# Altium schematic sheet GeekIMUv1.SchDoc
size 381 x 190 mm
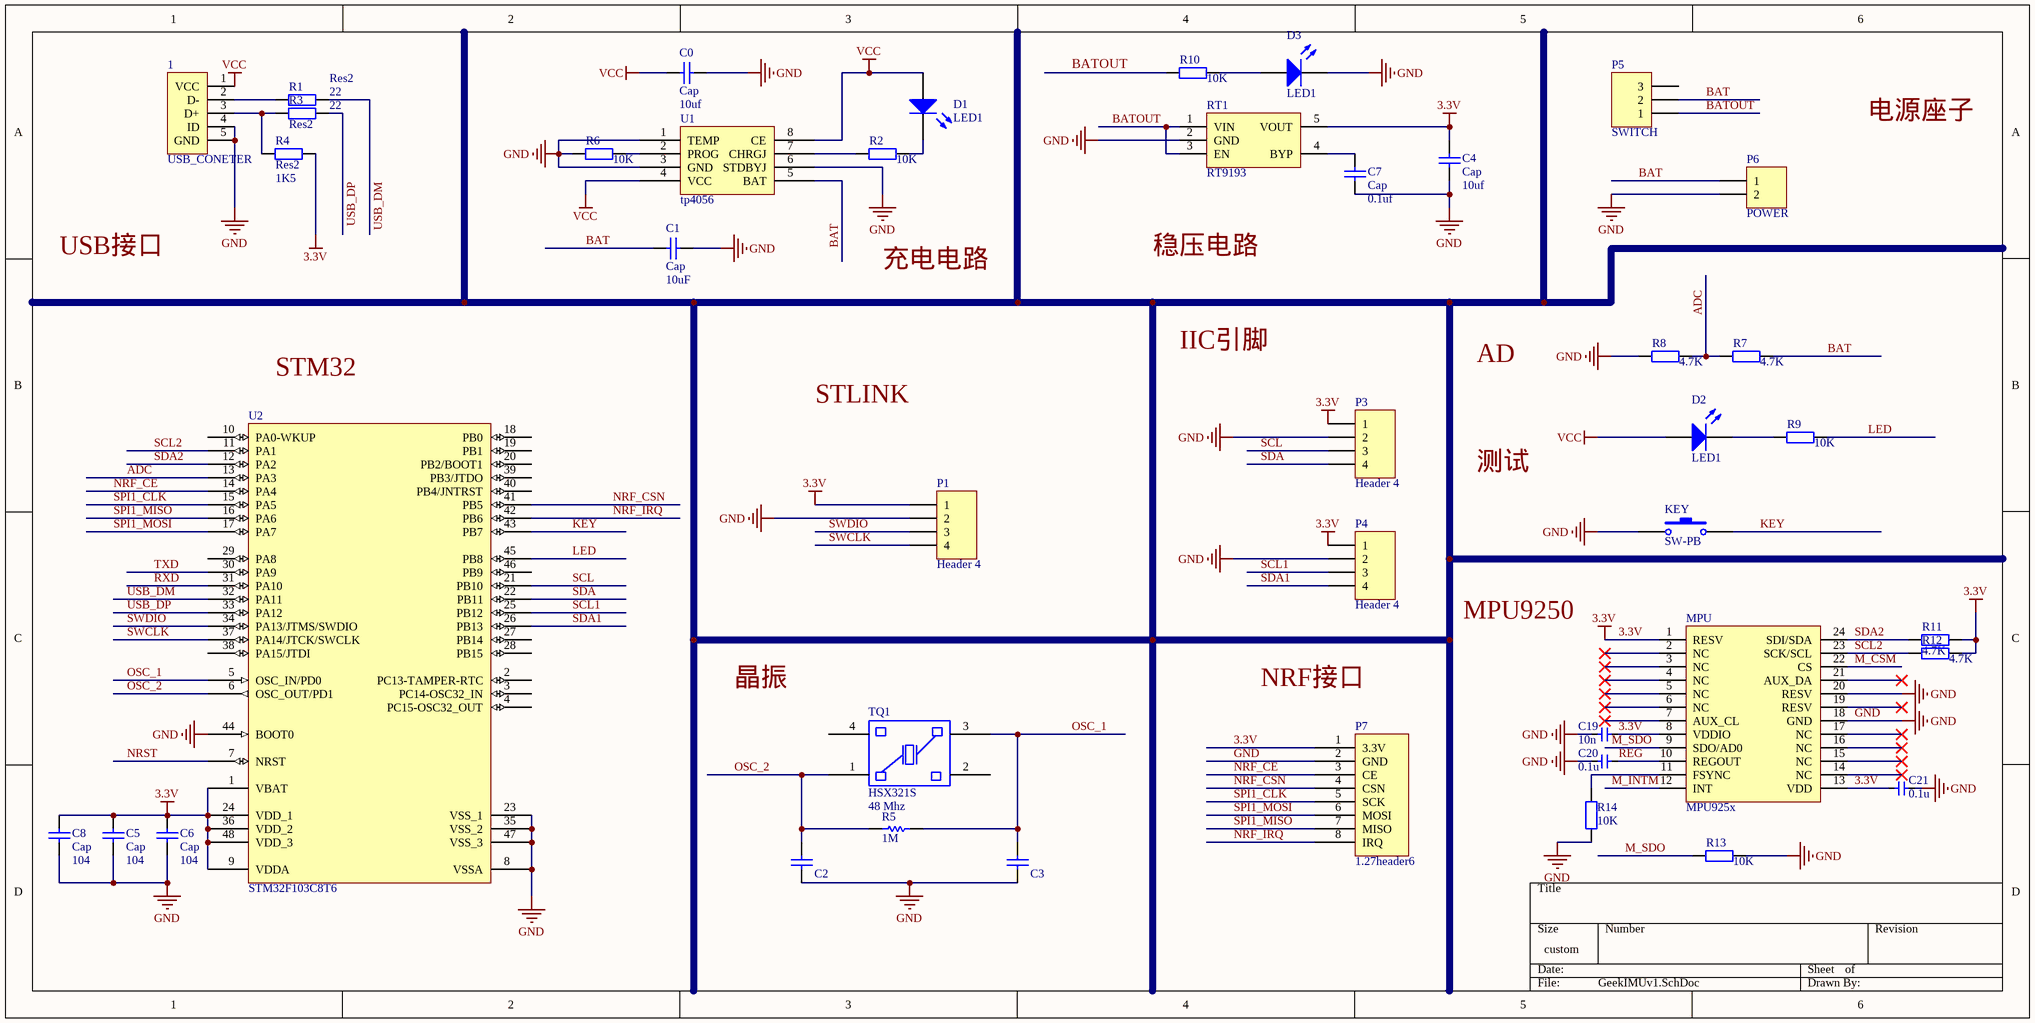
[diagram p0: GeekIMUv1.SchDoc]

## Parts
1  USB_CONETER  [Mini USB]
C0  Cap  value 10uf  [C0603]
C1  Cap  value 10uF  [C0603]
C2  Cap  [C0402]  (value not drawn)
C3  Cap  [C0402]  (value not drawn)
C4  Cap  value 10uf  [C0603]
C5  Cap  value 104  [C0402]
C6  Cap  value 104  [C0402]
C7  Cap  value 0.1uf  [B0402]
C8  Cap  value 104  [C0402]
C19  value 10n  [C0402]  (hidden comment: Cap_0603)
C20  value 0.1u  [C0402]  (hidden comment: Cap_0603)
C21  value 0.1u  [C0402]  (hidden comment: Cap_0603)
D1  LED1  [C0402]
D2  LED1  [C0402]
D3  LED1  [C0402]
KEY  SW-PB  [SW-SMD1]
MPU  MPU925x  [QFN_P0.4_24]
P1  Header 4  [HDR1X4]
P3  Header 4  [HDR1X4]
P4  Header 4  [HDR1X4]
P5  SWITCH  [HDR1X3]
P6  POWER  [HDR1X2]
P7  1.27header6  [1.27header6]
R1  Res2  value 22  [B0402]
R2  value 10K  [B0402]
R3  Res2  value 22  [B0402]
R4  Res2  value 1K5  [B0402]
R5  value 1M  [R0402]  (hidden comment: Res Semi)
R6  value 10K  [B0402]
R7  value 4.7K  [B0402]
R8  value 4.7K  [B0402]
R9  value 10K  [B0402]
R10  value 10K  [B0402]
R11  value 4.7K  [B0402]
R12  value 4.7K  [B0402]
R13  value 10K  [B0402]
R14  value 10K  [B0402]
RT1  RT9193  [SOT23-5]
TQ1  HSX321S  value 48 Mhz  [DSX321G]
U1  tp4056  [SOP8]
U2  STM32F103C8T6  [LQFP_P0.5_48]

## Nets
3.3V: C4.2 C5.2 C6.2 C8.2 C19.2 C21.2 MPU.1(RESV) MPU.8(VDDIO) MPU.13(VDD) P1.1 P3.1 P4.1 P7.1(3.3V) R4.2 R11.1 R12.1 RT1.5(VOUT) U2.1(VBAT) U2.9(VDDA) U2.24(VDD_1) U2.36(VDD_2) U2.48(VDD_3)
GND: 1.4(ID) 1.5(GND) C0.2 C1.1 C2.1 C3.1 C4.1 C5.1 C6.1 C7.1 C8.1 C19.1 C20.1 C21.1 D3.2(K) KEY.1 MPU.18(GND) MPU.20(RESV) P1.2 P3.2 P4.2 P6.2 P7.2(GND) R6.2 R8.2 R13.1 R14.2 RT1.2(GND) U1.1(TEMP) U1.3(GND) U1.6(STDBYJ) U2.8(VSSA) U2.23(VSS_1) U2.35(VSS_2) U2.44(BOOT0) U2.47(VSS_3)
VCC: 1.1(VCC) C0.1 D1.1(A) D2.1(A) U1.4(VCC) U1.8(CE)
ADC: R7.2 R8.1 U2.13(PA3)
BAT: C1.2 P5.2 P6.1 R7.1 U1.5(BAT)
BATOUT: P5.1 R10.2 RT1.1(VIN) RT1.3(EN)
KEY: KEY.2 U2.43(PB7)
LED: R9.1 U2.45(PB8)
M_CSM: MPU.22(CS)
M_INTM: MPU.12(INT)
M_SDO: MPU.9(SDO/AD0) R13.2
NRF_CE: P7.3(CE) U2.14(PA4)
NRF_CSN: P7.4(CSN) U2.41(PB5)
NRF_IRQ: P7.8(IRQ) U2.42(PB6)
NRST: U2.7(NRST)
OSC_1: C3.2 R5.2 TQ1.3 U2.5(OSC_IN/PD0)
OSC_2: C2.2 R5.1 TQ1.1 U2.6(OSC_OUT/PD1)
REG: C20.2 MPU.10(REGOUT)
RXD: U2.31(PA10)
SCL: P3.3 U2.21(PB10)
SCL1: P4.3 U2.25(PB12)
SCL2: MPU.23(SCK/SCL) R12.2 U2.11(PA1)
SDA: P3.4 U2.22(PB11)
SDA1: P4.4 U2.26(PB13)
SDA2: MPU.24(SDI/SDA) R11.2 U2.12(PA2)
SPI1_CLK: P7.5(SCK) U2.15(PA5)
SPI1_MISO: P7.7(MISO) U2.16(PA6)
SPI1_MOSI: P7.6(MOSI) U2.17(PA7)
SWCLK: P1.4 U2.37(PA14/JTCK/SWCLK)
SWDIO: P1.3 U2.34(PA13/JTMS/SWDIO)
TXD: U2.30(PA9)
USB_DM: R1.2 U2.32(PA11)
USB_DP: R3.2 U2.33(PA12)
Net1_2: 1.2(D-) R1.1
Net1_3: 1.3(D+) R3.1 R4.1
NetC7_2: C7.2 RT1.4(BYP)
NetD1_2: D1.2(K) R2.1
NetD2_2: D2.2(K) R9.2
NetD3_1: D3.1(A) R10.1
NetMPU_11: MPU.11(FSYNC) R14.1
NetR2_2: R2.2 U1.7(CHRGJ)
NetR6_1: R6.1 U1.2(PROG)

Not connected (* = marked no-connect by the designer): MPU 2(NC)* 3(NC)* 4(NC)* 5(NC)* 6(NC)* 7(AUX_CL)* 14(NC)* 15(NC)* 16(NC)* 17(NC)* 19(RESV)* 21(AUX_DA)*; P5 3; TQ1 2 4; U2 2(PC13-TAMPER-RTC) 3(PC14-OSC32_IN) 4(PC15-OSC32_OUT) 10(PA0-WKUP) 18(PB0) 19(PB1) 20(PB2/BOOT1) 27(PB14) 28(PB15) 29(PA8) 38(PA15/JTDI) 39(PB3/JTDO) 40(PB4/JNTRST) 46(PB9)

## Notes on the sheet
- Labels drawn without touching a wire or pin: AD, IIC引脚, MPU9250, NRF接口, STLINK, STM32, USB接口, 充电电路, 晶振, 测试, 电源座子, 稳压电路

## Library data of the parts
1 = USB_conect_B: USB; Published: 24-Mar-1999; LatestRevisionDate: 17-Jul-2002; LatestRevisionNote: Re-released for DXP Platform.; PackageReference: D2PAK; Publisher: Altium Limited; Code_JEDEC: SMD-220
C0 C1 C4-C8 = Cap: Capacitor; Published: 8-Jun-2000; LatestRevisionDate: 17-Jul-2002; LatestRevisionNote: Re-released for DXP Platform.; PackageReference: RAD-0.3; Publisher: Altium Limited
  C0 C4 C7: PackageDescription: Radial Cap, Thru-Hole; 2 Leads; 0.3 in Pin Spacing
C2 C3 = Cap: Product model: Product?; Value: Value?; Vendor: Vendor?
C19-C21 = Cap_0603: Capacitor
D1-D3 = LED1: Typical RED GaAs LED; Published: 8-Jun-2000; LatestRevisionDate: 08-Jul-2005; LatestRevisionNote: Mech Layer 1 removed.; PackageReference: LED-1; Publisher: Altium Limited
KEY = SW-PB: Switch; Published: 24-Mar-1999; LatestRevisionDate: 17-Jul-2002; LatestRevisionNote: Re-released for DXP Platform.; PackageReference: SPST-2; Publisher: Altium Limited
MPU = MPU925x: Sensor Motion
P1 P3 P4 = Header 4: Header, 4-Pin; LatestRevisionDate: 17-Jul-2002; LatestRevisionNote: Re-released for DXP Platform.; Publisher: Altium Limited
P5 = Header 3: Header, 3-Pin; LatestRevisionDate: 17-Jul-2002; LatestRevisionNote: Re-released for DXP Platform.; Publisher: Altium Limited
P6 = Header 2: Header, 2-Pin; LatestRevisionDate: 17-Jul-2002; LatestRevisionNote: Re-released for DXP Platform.; Publisher: Altium Limited
R1-R4 R6-R14 = Res2: Resistor; Published: 8-Jun-2000; LatestRevisionDate: 17-Jul-2002; LatestRevisionNote: Re-released for DXP Platform.; PackageReference: AXIAL-0.4; Publisher: Altium Limited
R5 = Res Semi: Semiconductor Resistor; Vendor: V?; Product model: P?
RT1 = RT9193: Power
TQ1 = HSX321S: XTAL; Vendor: TXC,台湾晶技; Product model: 7C Series
U1 = Component_1
U2 = STM32F103C8T6: STM32 ARM-based 32-bit MCU with 64 Kbytes Flash, 48-pin LQFP, Industrial Temperature; Published: 30-May-2008; DatasheetVersion: rev6, Mar-2008; PackageVersion: Mar-2008; PackageReference: LQFP48; Publisher: Altium Limited; PackageDescription: 48-Pin Low-Profile Quad Flat Pack, 7 x 7 mm Body, 0.5 mm Pitch (LQFP48); ComponentLink1Description: Manufacturer Link; ComponentLink1URL: www.st.com/stm32; ComponentLink2Description: Datasheet; ComponentLink2URL: http://www.st.com/stonline/products/literature/ds/13587.pdf